# Altium schematic sheet EXP_OBC_COMM.SchDoc
size 420 x 297 mm; SheetNumber: 5; SheetTotal: 12
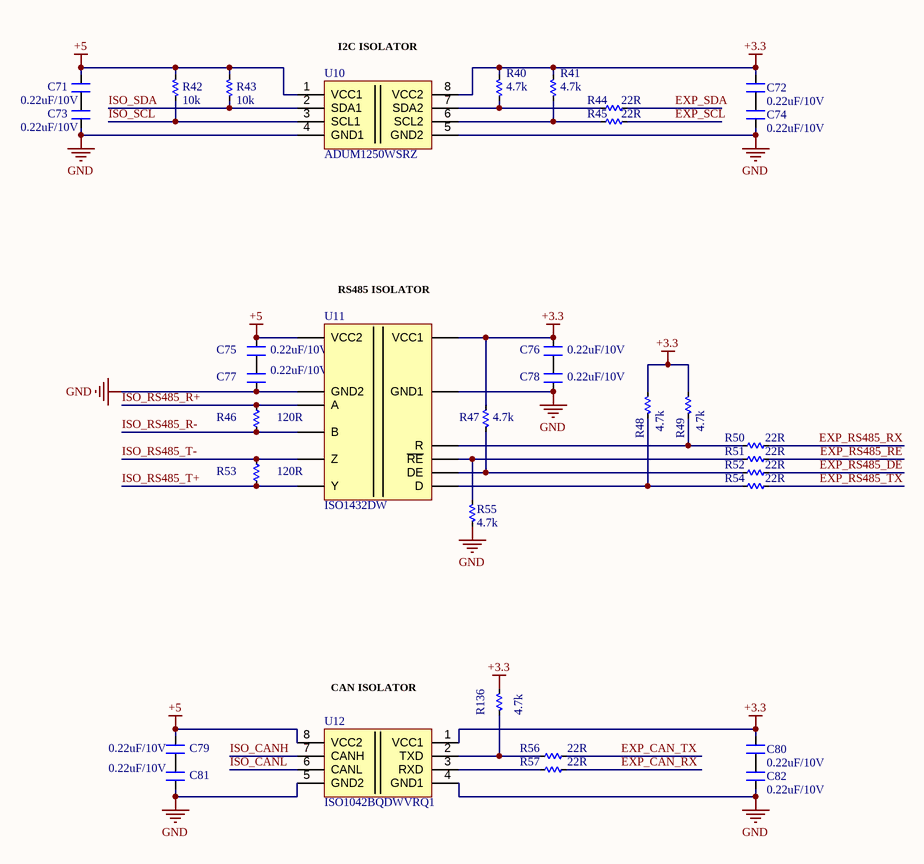
[diagram p0: EXP_OBC_COMM.SchDoc]

## Parts
C71  0.22uF/10V  [CAP_C_1608X80]
C72  0.22uF/10V  [CAP_C_1608X80]
C73  0.22uF/10V  [CAP_C_1608X80]
C74  0.22uF/10V  [CAP_C_1608X80]
C75  0.22uF/10V  [CAP_C_1608X80]
C76  0.22uF/10V  [CAP_C_1608X80]
C77  0.22uF/10V  [CAP_C_1608X80]
C78  0.22uF/10V  [CAP_C_1608X80]
C79  0.22uF/10V  [CAP_C_1608X80]
C80  0.22uF/10V  [CAP_C_1608X80]
C81  0.22uF/10V  [CAP_C_1608X80]
C82  0.22uF/10V  [CAP_C_1608X80]
R40  4.7k  [RES_C_1608X60]
R41  4.7k  [RES_C_1608X60]
R42  10k  [RES_C_1608X60]
R43  10k  [RES_C_1608X60]
R44  22R  [RES_C_1608X60]
R45  22R  [RES_C_1608X60]
R46  120R  [RES_C_1608X60]
R47  4.7k  [RES_C_1608X60]
R48  4.7k  [RES_C_1608X60]
R49  4.7k  [RES_C_1608X60]
R50  22R  [RES_C_1608X60]
R51  22R  [RES_C_1608X60]
R52  22R  [RES_C_1608X60]
R53  120R  [RES_C_1608X60]
R54  22R  [RES_C_1608X60]
R55  4.7k  [RES_C_1608X60]
R56  22R  [RES_C_1608X60]
R57  22R  [RES_C_1608X60]
R136  4.7k  [RES_C_1608X60]
U10  ADUM1250WSRZ  [SOIC-8]
U11  ISO1432DW  [ISO1432DW]
U12  ISO1042BQDWVRQ1  [ISO1042]

## Nets
+3.3: C72.2 C76.2 C80.2 R40.2 R41.2 R47.2 R48.2 R49.2 R136.2 U10.8(VCC2) U11.1(VCC1) U12.1(VCC1)
+5: C71.2 C75.2 C79.2 R42.2 R43.2 U10.1(VCC1) U11.16(VCC2) U12.8(VCC2)
GND: C73.1 C74.1 C77.1 C78.1 C81.1 C82.1 R55.2 U10.4(GND1) U10.5(GND2) U11.2,8(GND1) U11.9,15(GND2) U12.4(GND1) U12.5(GND2)
EXP_CAN_RX: R57.2
EXP_CAN_TX: R56.2
EXP_RS485_DE: R52.2
EXP_RS485_~{RE}: R51.2
EXP_RS485_RX: R50.2
EXP_RS485_TX: R54.2
EXP_SCL: R45.2
EXP_SDA: R44.2
ISO_CANH: U12.7(CANH)
ISO_CANL: U12.6(CANL)
ISO_RS485_R+: R46.2 U11.14(A)
ISO_RS485_R-: R46.1 U11.13(B)
ISO_RS485_T+: R53.1 U11.11(Y)
ISO_RS485_T-: R53.2 U11.12(Z)
ISO_SCL: R42.1 U10.3(SCL1)
ISO_SDA: R43.1 U10.2(SDA1)
NetC71_1: C71.1 C73.2
NetC72_1: C72.1 C74.2
NetC75_1: C75.1 C77.2
NetC76_1: C76.1 C78.2
NetC79_1: C79.1 C81.2
NetC80_1: C80.1 C82.2
NetR40_1: R40.1 R44.1 U10.7(SDA2)
NetR41_1: R41.1 R45.1 U10.6(SCL2)
NetR47_1: R47.1 R52.1 U11.5(DE)
NetR48_1: R48.1 R54.1 U11.6(D)
NetR49_1: R49.1 R50.1 U11.3(R)
NetR51_1: R51.1 R55.1 U11.4(~{RE})
NetR56_1: R56.1 R136.1 U12.2(TXD)
NetR57_1: R57.1 U12.3(RXD)

## Notes on the sheet
- (near U10) I2C ISOLATOR
- (near U11) RS485 ISOLATOR
- (near U12) CAN ISOLATOR
- Project:
- BEE-PC1
- Sub-system:
- NANORACK_EXP_CONTROLLER
- Design by:
- SANG HUYNH
- BAO BUI Q.
- Sheet title:
- Sheet
- A3
- of
- Checked by:
- Approved by:
- VU PHAM
- Revision:
- Document No:
- V1.1.0
- Size:
- Date:

## Library data of the parts
C71-C82 = Capacitors: Value: 33pF
R40-R57 R136 = Res SMD: SMD; Manufacturer: Generic Components; Class: Passive; Published: 08/06/2000; Publisher: Altium Hobart Technology Centre
U10 = ADUM1250
U11 = ISO1432DW: IC TRANSCEIVER FULL 1/1 16SOIC
U12 = ISO1042: IC TRANSCEIVER FULL 1/1 8SOIC